# EAGLE schematic transistor_schematic (EAGLE 9.6.2)
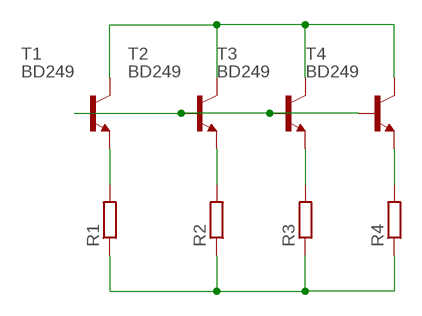
[diagram p0: schematic, sheet 1]

## Parts
R1  R-EU_VTA53  [VTA53]
R2  R-EU_VTA53  [VTA53]
R3  R-EU_VTA53  [VTA53]
R4  R-EU_VTA53  [VTA53]
T1  BD249  [TOP3]
T2  BD249  [TOP3]
T3  BD249  [TOP3]
T4  BD249  [TOP3]

## Nets
N$1: R1.2 T1.3(E)
N$2: R2.2 T2.3(E)
N$3: R3.2 T3.3(E)
N$4: R1.1 R2.1 R3.1 R4.1
N$5: T1.2(C) T2.2(C) T3.2(C) T4.2(C)
N$7: T1.1(B) T2.1(B) T3.1(B) T4.1(B)
N$8: R4.2 T4.3(E)

## Library data of the parts
R1-R4 = rcl:R-EU_: RESISTOR, European symbol; SPICEPREFIX: R
T1-T4 = transistor-neu-to92:BD249: NPN TRANSISTOR